# EAGLE design MF_badge_2021_protoshield_ver_B (EAGLE 9.6.2)
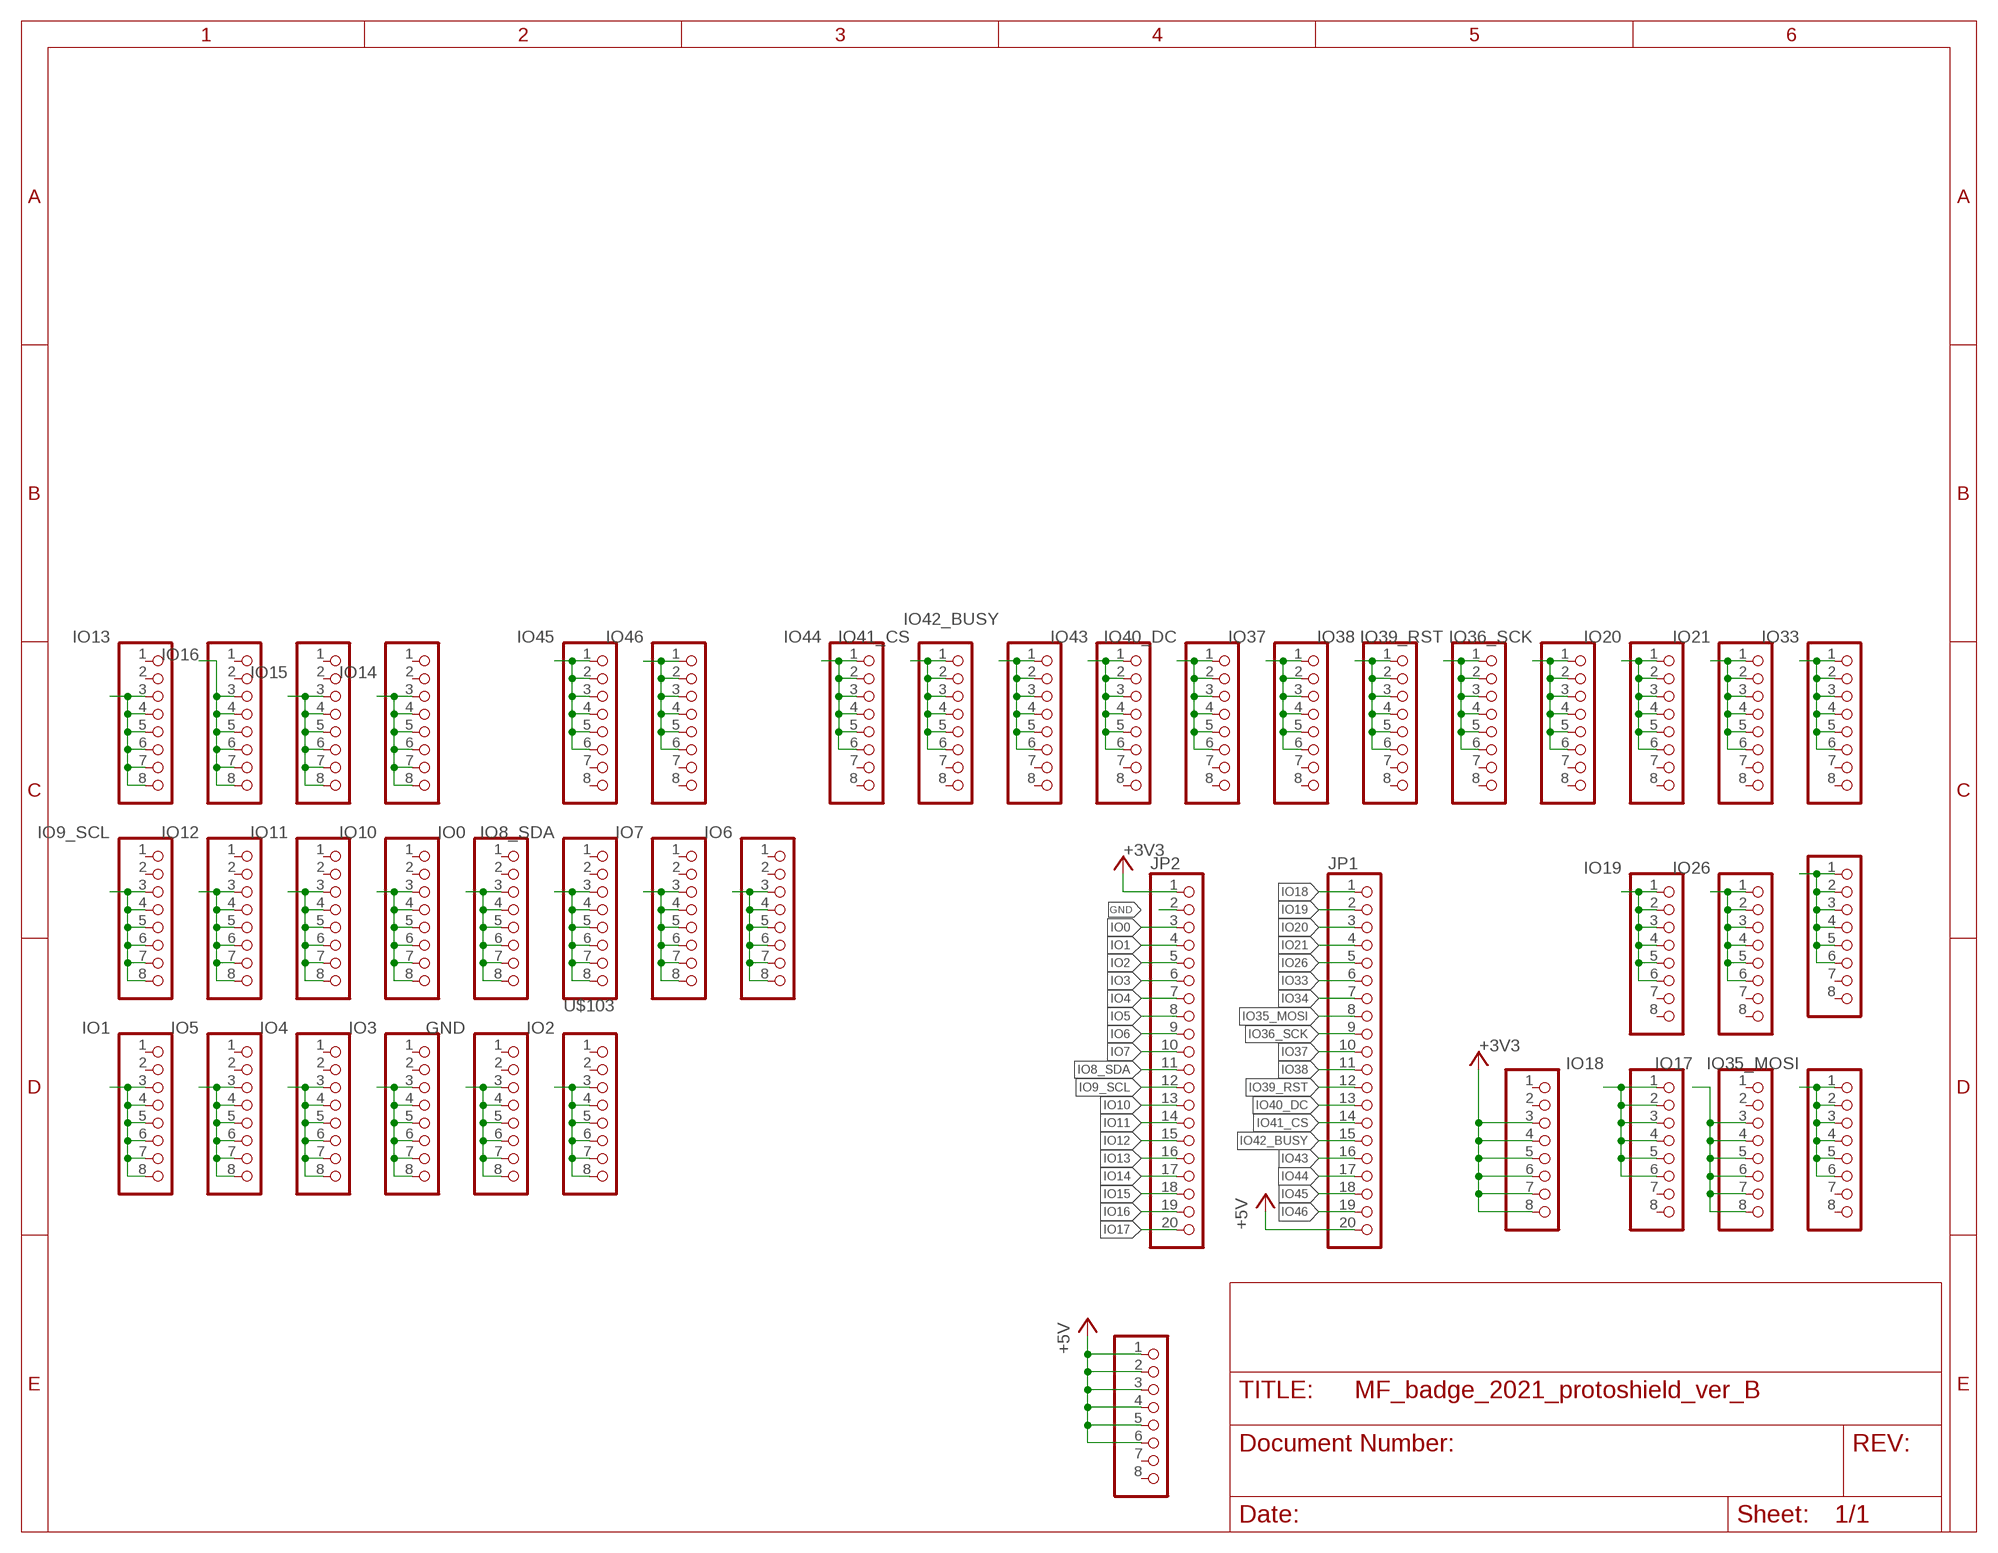
[diagram p0: schematic, sheet 1]

## Parts
JP1  PINHD-1X20_CLEANBIG  [1X20-CLEANBIG]
JP2  PINHD-1X20_CLEANBIG  [1X20-CLEANBIG]
U$1  PINHD-1X8CLEANBIG  [1X08-CLEANBIG]
U$5  PINHD-1X8CLEANBIG  [1X08-CLEANBIG]
U$7  PINHD-1X8CLEANBIG  [1X08-CLEANBIG]
U$8  PINHD-1X8CLEANBIG  [1X08-CLEANBIG]
U$9  PINHD-1X8CLEANBIG  [1X08-CLEANBIG]
U$10  PINHD-1X8CLEANBIG  [1X08-CLEANBIG]
U$11  PINHD-1X8CLEANBIG  [1X08-CLEANBIG]
U$12  PINHD-1X8CLEANBIG  [1X08-CLEANBIG]
U$13  PINHD-1X8CLEANBIG  [1X08-CLEANBIG]
U$14  PINHD-1X8CLEANBIG  [1X08-CLEANBIG]
U$15  PINHD-1X8CLEANBIG  [1X08-CLEANBIG]
U$36  PINHD-1X8CLEANBIG  [1X08-CLEANBIG]
U$52  PINHD-1X8CLEANBIG  [1X08-CLEANBIG]
U$53  PINHD-1X8CLEANBIG  [1X08-CLEANBIG]
U$54  PINHD-1X8CLEANBIG  [1X08-CLEANBIG]
U$55  PINHD-1X8CLEANBIG  [1X08-CLEANBIG]
U$56  PINHD-1X8CLEANBIG  [1X08-CLEANBIG]
U$61  PINHD-1X8CLEANBIG  [1X08-CLEANBIG]
U$62  PINHD-1X8CLEANBIG  [1X08-CLEANBIG]
U$63  PINHD-1X8CLEANBIG  [1X08-CLEANBIG]
U$64  PINHD-1X8CLEANBIG  [1X08-CLEANBIG]
U$102  PINHD-1X8CLEANBIG  [1X08-CLEANBIG]
U$103  PINHD-1X8CLEANBIG  [1X08-CLEANBIG]
U$104  PINHD-1X8CLEANBIG  [1X08-CLEANBIG]
U$105  PINHD-1X8CLEANBIG  [1X08-CLEANBIG]
U$106  PINHD-1X8CLEANBIG  [1X08-CLEANBIG]
U$107  PINHD-1X8CLEANBIG  [1X08-CLEANBIG]
U$108  PINHD-1X8CLEANBIG  [1X08-CLEANBIG]
U$109  PINHD-1X8CLEANBIG  [1X08-CLEANBIG]
U$110  PINHD-1X8CLEANBIG  [1X08-CLEANBIG]
U$111  PINHD-1X8CLEANBIG  [1X08-CLEANBIG]
U$112  PINHD-1X8CLEANBIG  [1X08-CLEANBIG]
U$113  PINHD-1X8CLEANBIG  [1X08-CLEANBIG]
U$114  PINHD-1X8CLEANBIG  [1X08-CLEANBIG]
U$115  PINHD-1X8CLEANBIG  [1X08-CLEANBIG]
U$116  PINHD-1X8CLEANBIG  [1X08-CLEANBIG]
U$117  PINHD-1X8CLEANBIG  [1X08-CLEANBIG]
U$118  PINHD-1X8CLEANBIG  [1X08-CLEANBIG]
U$119  PINHD-1X8CLEANBIG  [1X08-CLEANBIG]
U$120  PINHD-1X8CLEANBIG  [1X08-CLEANBIG]

## Nets
+3V3 [power]: JP2.1 U$1.3 U$1.4 U$1.5 U$1.6 U$1.7 U$1.8
+5V: JP1.20 U$102.1 U$102.2 U$102.3 U$102.4 U$102.5 U$102.6
GND: JP2.2 U$120.3 U$120.4 U$120.5 U$120.6 U$120.7 U$120.8
IO0: JP2.3 U$115.3 U$115.4 U$115.5 U$115.6 U$115.7 U$115.8
IO1: JP2.4 U$119.3 U$119.4 U$119.5 U$119.6 U$119.7 U$119.8
IO2: JP2.5 U$103.3 U$103.4 U$103.5 U$103.6 U$103.7 U$103.8
IO3: JP2.6 U$118.3 U$118.4 U$118.5 U$118.6 U$118.7 U$118.8
IO4: JP2.7 U$117.3 U$117.4 U$117.5 U$117.6 U$117.7 U$117.8
IO5: JP2.8 U$116.3 U$116.4 U$116.5 U$116.6 U$116.7 U$116.8
IO6: JP2.9 U$114.3 U$114.4 U$114.5 U$114.6 U$114.7 U$114.8
IO7: JP2.10 U$113.3 U$113.4 U$113.5 U$113.6 U$113.7 U$113.8
IO8_SDA: JP2.11 U$112.3 U$112.4 U$112.5 U$112.6 U$112.7 U$112.8
IO9_SCL: JP2.12 U$111.3 U$111.4 U$111.5 U$111.6 U$111.7 U$111.8
IO10: JP2.13 U$110.3 U$110.4 U$110.5 U$110.6 U$110.7 U$110.8
IO11: JP2.14 U$109.3 U$109.4 U$109.5 U$109.6 U$109.7 U$109.8
IO12: JP2.15 U$108.3 U$108.4 U$108.5 U$108.6 U$108.7 U$108.8
IO13: JP2.16 U$107.3 U$107.4 U$107.5 U$107.6 U$107.7 U$107.8
IO14: JP2.17 U$106.3 U$106.4 U$106.5 U$106.6 U$106.7 U$106.8
IO15: JP2.18 U$105.3 U$105.4 U$105.5 U$105.6 U$105.7 U$105.8
IO16: JP2.19 U$104.3 U$104.4 U$104.5 U$104.6 U$104.7 U$104.8
IO17: JP2.20 U$7.3 U$7.4 U$7.5 U$7.6 U$7.7 U$7.8
IO18: JP1.1 U$5.1 U$5.2 U$5.3 U$5.4 U$5.5 U$5.6
IO19: JP1.2 U$8.1 U$8.2 U$8.3 U$8.4 U$8.5 U$8.6
IO20: JP1.3 U$9.1 U$9.2 U$9.3 U$9.4 U$9.5 U$9.6
IO21: JP1.4 U$10.1 U$10.2 U$10.3 U$10.4 U$10.5 U$10.6
IO26: JP1.5 U$11.1 U$11.2 U$11.3 U$11.4 U$11.5 U$11.6
IO33: JP1.6 U$12.1 U$12.2 U$12.3 U$12.4 U$12.5 U$12.6
IO34: JP1.7 U$13.1 U$13.2 U$13.3 U$13.4 U$13.5 U$13.6
IO35_MOSI: JP1.8 U$14.1 U$14.2 U$14.3 U$14.4 U$14.5 U$14.6
IO36_SCK: JP1.9 U$15.1 U$15.2 U$15.3 U$15.4 U$15.5 U$15.6
IO37: JP1.10 U$36.1 U$36.2 U$36.3 U$36.4 U$36.5 U$36.6
IO38: JP1.11 U$52.1 U$52.2 U$52.3 U$52.4 U$52.5 U$52.6
IO39_RST: JP1.12 U$53.1 U$53.2 U$53.3 U$53.4 U$53.5 U$53.6
IO40_DC: JP1.13 U$54.1 U$54.2 U$54.3 U$54.4 U$54.5 U$54.6
IO41_CS: JP1.14 U$55.1 U$55.2 U$55.3 U$55.4 U$55.5 U$55.6
IO42_BUSY: JP1.15 U$56.1 U$56.2 U$56.3 U$56.4 U$56.5 U$56.6
IO43: JP1.16 U$61.1 U$61.2 U$61.3 U$61.4 U$61.5 U$61.6
IO44: JP1.17 U$62.1 U$62.2 U$62.3 U$62.4 U$62.5 U$62.6
IO45: JP1.18 U$63.1 U$63.2 U$63.3 U$63.4 U$63.5 U$63.6
IO46: JP1.19 U$64.1 U$64.2 U$64.3 U$64.4 U$64.5 U$64.6
Unconnected: U$1.1 U$1.2 U$5.7 U$5.8 U$7.1 U$7.2 U$8.7 U$8.8 U$9.7 U$9.8 U$10.7 U$10.8 U$11.7 U$11.8 U$12.7 U$12.8 U$13.7 U$13.8 U$14.7 U$14.8 U$15.7 U$15.8 U$36.7 U$36.8 U$52.7 U$52.8 U$53.7 U$53.8 U$54.7 U$54.8 U$55.7 U$55.8 U$56.7 U$56.8 U$61.7 U$61.8 U$62.7 U$62.8 U$63.7 U$63.8 U$64.7 U$64.8 U$102.7 U$102.8 U$103.1 U$103.2 U$104.1 U$104.2 U$105.1 U$105.2 U$106.1 U$106.2 U$107.1 U$107.2 U$108.1 U$108.2 U$109.1 U$109.2 U$110.1 U$110.2 U$111.1 U$111.2 U$112.1 U$112.2 U$113.1 U$113.2 U$114.1 U$114.2 U$115.1 U$115.2 U$116.1 U$116.2 U$117.1 U$117.2 U$118.1 U$118.2 U$119.1 U$119.2 U$120.1 U$120.2

## Library data of the parts
JP1 JP2 = dronecz:PINHD-1X20: PIN HEADER
U$1 U$5 U$7-U$15 U$36 U$52-U$56 U$61-U$64 U$102-U$120 = adafruit:PINHD-1X8: PIN HEADER

## Net classes
1 power: width 0.508 mm
2 lowpower: width 0.305 mm, drill 0.483 mm

## Board
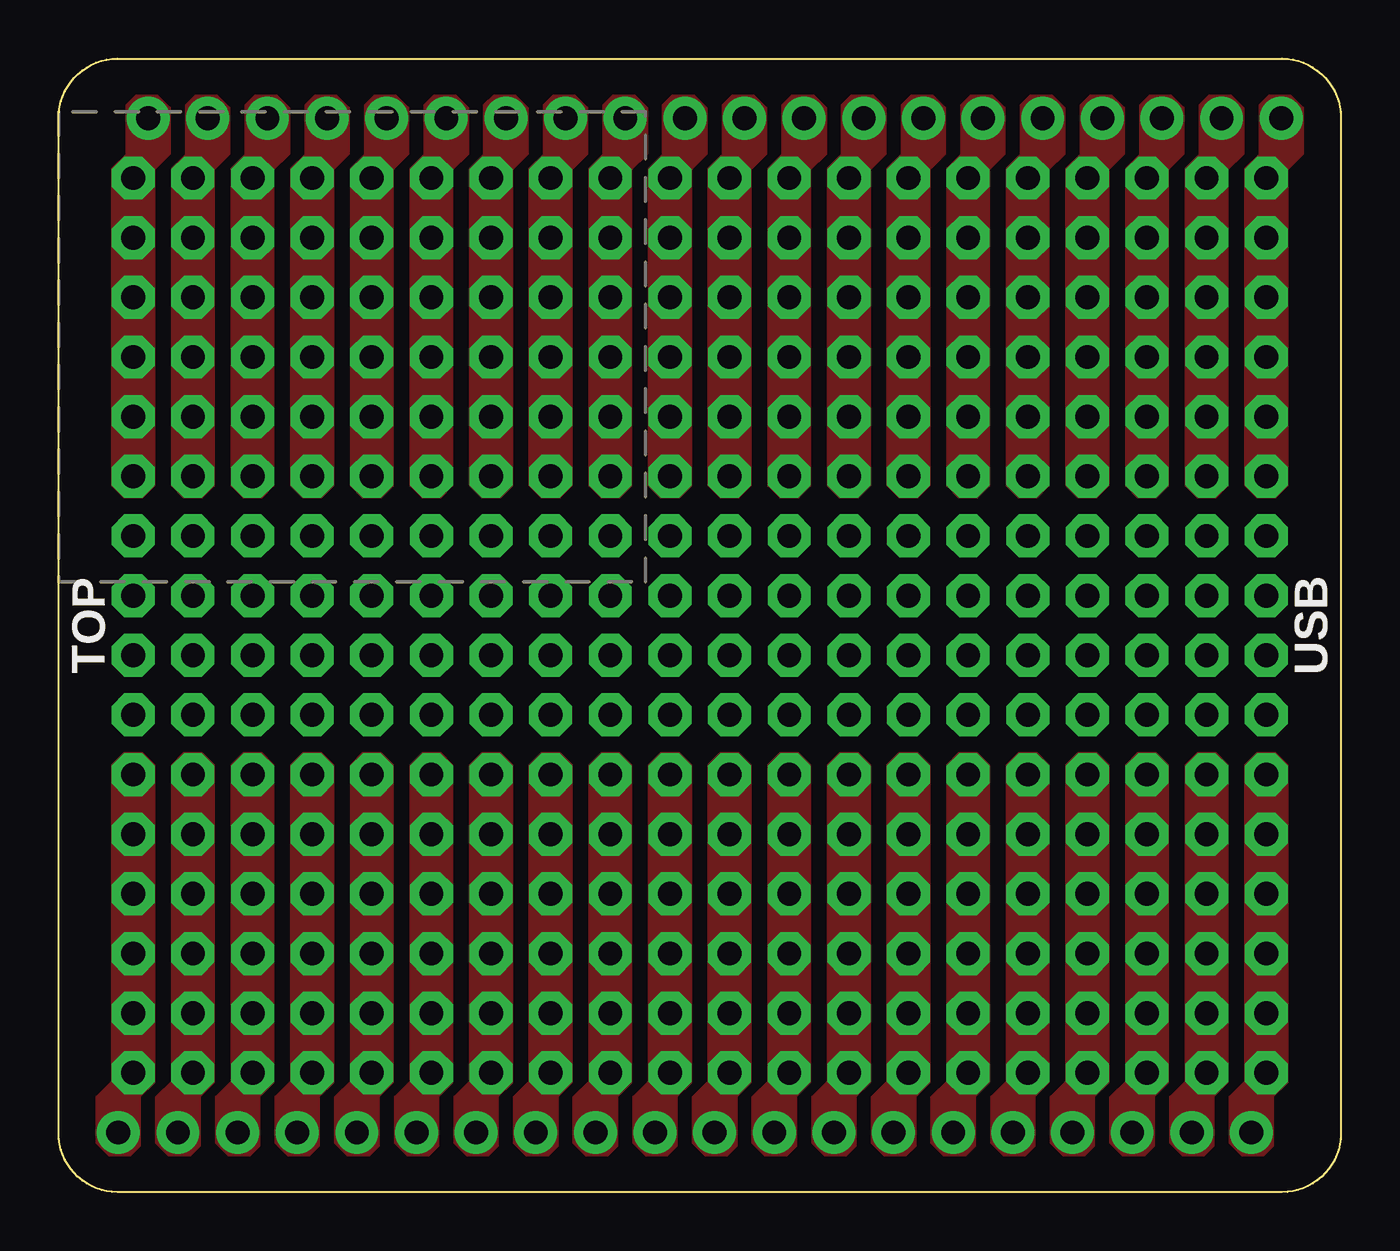
[diagram p1: board, top side]
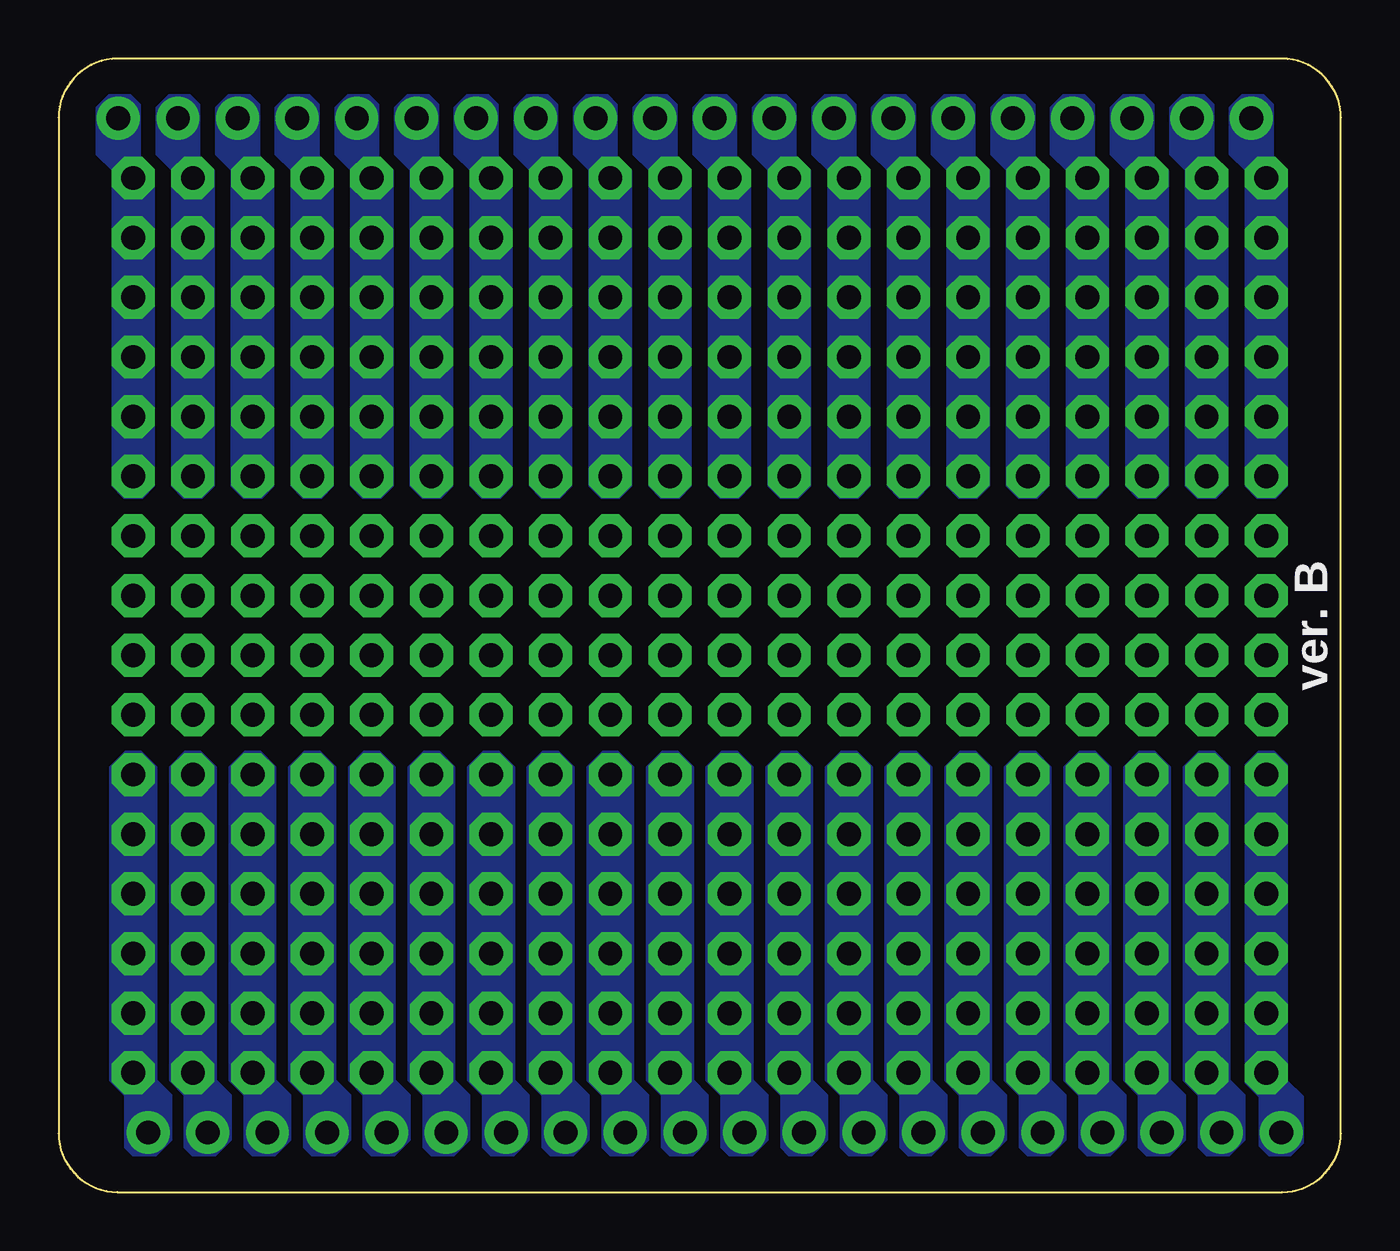
[diagram p2: board, bottom side, seen from below]

Size 54.61 x 48.26 mm. Coordinates in mm from the lower left corner, seen from the top.
Outline: 54.61,45.76 54.61,2.5 arc-90 52.11,0 2.5,0 arc-90 0,2.5 0,45.76 arc-90 2.5,48.26 52.11,48.26 arc-90 54.61,45.76
Copper layers (1*16): Top 0.035mm / dielectric 1.6mm / Bottom 0.035mm
Design rules "jlcpcb2layer *": minimum track width 5mil, minimum drill 0.3mm, track to track 5mil, track to pad 5mil, pad to pad 5mil, via to via 5mil, smd to smd 5mil, copper to edge 0.2mm, drill to drill 6mil, minimum pad ring 10mil, minimum via ring 3mil, stop-mask expansion 4mil, vias tented up to drill 0mil, thermal gap 10mil

### Footprints (pad centres in the part's own frame; a part is rotated, then mirrored left to right if it is on the bottom)
1X20-CLEANBIG = drill 1.016 pad 1.778: 1 -24.13,0; 2 -21.59,0; 3 -19.05,0; 4 -16.51,0; 5 -13.97,0; 6 -11.43,0; 7 -8.89,0; 8 -6.35,0; 9 -3.81,0; 10 -1.27,0; 11 1.27,0; 12 3.81,0; 13 6.35,0; 14 8.89,0; 15 11.43,0; 16 13.97,0; 17 16.51,0; 18 19.05,0; 19 21.59,0; 20 24.13,0
1X08-CLEANBIG = drill 1.016 pad 1.778 octagon: 1 -8.89,0; 2 -6.35,0; 3 -3.81,0; 4 -1.27,0; 5 1.27,0; 6 3.81,0; 7 6.35,0; 8 8.89,0

### Placement (x,y rotation side)
JP1  26.67,2.54 0 top
JP2  27.94,45.72 180 top
U$1  51.44,34.29 90 top
U$5  3.17,13.97 90 top
U$7  3.17,34.29 90 top
U$8  5.71,13.97 90 top
U$9  8.26,13.97 90 top
U$10  10.79,13.97 90 top
U$11  13.34,13.97 90 top
U$12  15.88,13.97 90 top
U$13  18.41,13.97 90 top
U$14  20.95,13.97 90 top
U$15  23.5,13.97 90 top
U$36  26.04,13.97 90 top
U$52  28.57,13.97 90 top
U$53  31.11,13.97 90 top
U$54  33.66,13.97 90 top
U$55  36.2,13.97 90 top
U$56  38.73,13.97 90 top
U$61  41.27,13.97 90 top
U$62  43.81,13.97 90 top
U$63  46.35,13.97 90 top
U$64  48.9,13.97 90 top
U$102  51.44,13.97 90 top
U$103  41.27,34.29 90 top
U$104  5.71,34.29 90 top
U$105  8.26,34.29 90 top
U$106  10.79,34.29 90 top
U$107  13.34,34.29 90 top
U$108  15.88,34.29 90 top
U$109  18.41,34.29 90 top
U$110  20.95,34.29 90 top
U$111  23.5,34.29 90 top
U$112  26.04,34.29 90 top
U$113  28.57,34.29 90 top
U$114  31.11,34.29 90 top
U$115  46.35,34.29 90 top
U$116  33.66,34.29 90 top
U$117  36.2,34.29 90 top
U$118  38.73,34.29 90 top
U$119  43.81,34.29 90 top
U$120  48.9,34.29 90 top

### Tracks (layer width: path | path; a pad name or v marks a point on that pad's centre or on a via)
+3V3
  pour Top (no thermals): 50.55,43.59 51.15,44.2 51.15,46.3 51.55,46.7 52.46,46.7 52.99,46.17 52.99,44.2 52.32,43.53 52.32,30.07 51.82,29.56 51.05,29.56 50.55,30.07
  pour Bottom (no thermals): 51.82,29.59 51.05,29.59 50.58,30.07 50.58,43.5 51.18,44.1 51.18,46.29 51.56,46.67 52.45,46.67 52.96,46.16 52.96,44.2 52.29,43.53 52.29,30.07
+5V
  pour Top (no thermals): 52.32,4.67 51.72,4.06 51.72,1.96 51.32,1.56 50.41,1.56 49.88,2.09 49.88,4.06 50.55,4.73 50.55,18.19 51.05,18.7 51.82,18.7 52.32,18.19
  pour Bottom (no thermals): 51.12,18.73 51.75,18.73 52.39,18.1 52.39,4.76 51.75,4.13 51.75,1.91 51.44,1.59 50.48,1.59 49.85,2.22 49.85,4.13 50.48,4.76 50.48,18.1
GND
  pour Top (no thermals): 48.01,43.59 48.61,44.2 48.61,46.3 49.01,46.7 49.92,46.7 50.45,46.17 50.45,44.2 49.78,43.53 49.78,30.07 49.28,29.56 48.51,29.56 48.01,30.07
  pour Bottom (no thermals): 49.28,29.59 48.51,29.59 48.04,30.07 48.04,43.5 48.64,44.1 48.64,46.29 49.02,46.67 49.91,46.67 50.42,46.16 50.42,44.2 49.75,43.53 49.75,30.07
IO0
  pour Top (no thermals): 45.47,43.59 46.07,44.2 46.07,46.3 46.47,46.7 47.38,46.7 47.91,46.17 47.91,44.2 47.24,43.53 47.24,30.07 46.74,29.56 45.97,29.56 45.47,30.07
  pour Bottom (no thermals): 46.74,29.59 45.97,29.59 45.5,30.07 45.5,43.5 46.1,44.1 46.1,46.29 46.48,46.67 47.37,46.67 47.88,46.16 47.88,44.2 47.21,43.53 47.21,30.07
IO1
  pour Top (no thermals): 42.93,43.59 43.53,44.2 43.53,46.3 43.93,46.7 44.84,46.7 45.37,46.17 45.37,44.2 44.7,43.53 44.7,30.07 44.2,29.56 43.43,29.56 42.93,30.07
  pour Bottom (no thermals): 44.2,29.59 43.43,29.59 42.96,30.07 42.96,43.5 43.56,44.1 43.56,46.29 43.94,46.67 44.83,46.67 45.34,46.16 45.34,44.2 44.67,43.53 44.67,30.07
IO2
  pour Top (no thermals): 40.39,43.59 40.99,44.2 40.99,46.3 41.39,46.7 42.3,46.7 42.83,46.17 42.83,44.2 42.16,43.53 42.16,30.07 41.66,29.56 40.89,29.56 40.39,30.07
  pour Bottom (no thermals): 41.66,29.59 40.89,29.59 40.42,30.07 40.42,43.5 41.02,44.1 41.02,46.29 41.4,46.67 42.29,46.67 42.8,46.16 42.8,44.2 42.13,43.53 42.13,30.07
IO3
  pour Top (no thermals): 37.85,43.59 38.45,44.2 38.45,46.3 38.85,46.7 39.76,46.7 40.29,46.17 40.29,44.2 39.62,43.53 39.62,30.07 39.12,29.56 38.35,29.56 37.85,30.07
  pour Bottom (no thermals): 39.12,29.59 38.35,29.59 37.88,30.07 37.88,43.5 38.48,44.1 38.48,46.29 38.86,46.67 39.75,46.67 40.26,46.16 40.26,44.2 39.59,43.53 39.59,30.07
IO4
  pour Top (no thermals): 35.31,43.59 35.91,44.2 35.91,46.3 36.31,46.7 37.22,46.7 37.75,46.17 37.75,44.2 37.08,43.53 37.08,30.07 36.58,29.56 35.81,29.56 35.31,30.07
  pour Bottom (no thermals): 36.58,29.59 35.81,29.59 35.34,30.07 35.34,43.5 35.94,44.1 35.94,46.29 36.32,46.67 37.21,46.67 37.72,46.16 37.72,44.2 37.05,43.53 37.05,30.07
IO5
  pour Top (no thermals): 32.77,43.59 33.37,44.2 33.37,46.3 33.77,46.7 34.68,46.7 35.21,46.17 35.21,44.2 34.54,43.53 34.54,30.07 34.04,29.56 33.27,29.56 32.77,30.07
  pour Bottom (no thermals): 34.04,29.59 33.27,29.59 32.8,30.07 32.8,43.5 33.4,44.1 33.4,46.29 33.78,46.67 34.67,46.67 35.18,46.16 35.18,44.2 34.51,43.53 34.51,30.07
IO6
  pour Top (no thermals): 30.23,43.59 30.83,44.2 30.83,46.3 31.23,46.7 32.14,46.7 32.67,46.17 32.67,44.2 32,43.53 32,30.07 31.5,29.56 30.73,29.56 30.23,30.07
  pour Bottom (no thermals): 31.5,29.59 30.73,29.59 30.26,30.07 30.26,43.5 30.86,44.1 30.86,46.29 31.24,46.67 32.13,46.67 32.64,46.16 32.64,44.2 31.97,43.53 31.97,30.07
IO7
  pour Top (no thermals): 27.69,43.59 28.29,44.2 28.29,46.3 28.69,46.7 29.6,46.7 30.13,46.17 30.13,44.2 29.46,43.53 29.46,30.07 28.96,29.56 28.19,29.56 27.69,30.07
  pour Bottom (no thermals): 28.96,29.59 28.19,29.59 27.72,30.07 27.72,43.5 28.32,44.1 28.32,46.29 28.7,46.67 29.59,46.67 30.1,46.16 30.1,44.2 29.43,43.53 29.43,30.07
IO8_SDA
  pour Top (no thermals): 25.15,43.59 25.75,44.2 25.75,46.3 26.15,46.7 27.06,46.7 27.59,46.17 27.59,44.2 26.92,43.53 26.92,30.07 26.42,29.56 25.65,29.56 25.15,30.07
  pour Bottom (no thermals): 26.42,29.59 25.65,29.59 25.18,30.07 25.18,43.5 25.78,44.1 25.78,46.29 26.16,46.67 27.05,46.67 27.56,46.16 27.56,44.2 26.89,43.53 26.89,30.07
IO9_SCL
  pour Top (no thermals): 22.61,43.59 23.21,44.2 23.21,46.3 23.61,46.7 24.52,46.7 25.05,46.17 25.05,44.2 24.38,43.53 24.38,30.07 23.88,29.56 23.11,29.56 22.61,30.07
  pour Bottom (no thermals): 23.88,29.59 23.11,29.59 22.64,30.07 22.64,43.5 23.24,44.1 23.24,46.29 23.62,46.67 24.51,46.67 25.02,46.16 25.02,44.2 24.35,43.53 24.35,30.07
IO10
  pour Top (no thermals): 20.07,43.59 20.67,44.2 20.67,46.3 21.07,46.7 21.98,46.7 22.51,46.17 22.51,44.2 21.84,43.53 21.84,30.07 21.34,29.56 20.57,29.56 20.07,30.07
  pour Bottom (no thermals): 21.34,29.59 20.57,29.59 20.1,30.07 20.1,43.5 20.7,44.1 20.7,46.29 21.08,46.67 21.97,46.67 22.48,46.16 22.48,44.2 21.81,43.53 21.81,30.07
IO11
  pour Top (no thermals): 17.53,43.59 18.13,44.2 18.13,46.3 18.53,46.7 19.44,46.7 19.97,46.17 19.97,44.2 19.3,43.53 19.3,30.07 18.8,29.56 18.03,29.56 17.53,30.07
  pour Bottom (no thermals): 18.8,29.59 18.03,29.59 17.56,30.07 17.56,43.5 18.16,44.1 18.16,46.29 18.54,46.67 19.43,46.67 19.94,46.16 19.94,44.2 19.27,43.53 19.27,30.07
IO12
  pour Top (no thermals): 14.99,43.59 15.59,44.2 15.59,46.3 15.99,46.7 16.9,46.7 17.43,46.17 17.43,44.2 16.76,43.53 16.76,30.07 16.26,29.56 15.49,29.56 14.99,30.07
  pour Bottom (no thermals): 16.26,29.59 15.49,29.59 15.02,30.07 15.02,43.5 15.62,44.1 15.62,46.29 16,46.67 16.89,46.67 17.4,46.16 17.4,44.2 16.73,43.53 16.73,30.07
IO13
  pour Top (no thermals): 12.45,43.59 13.05,44.2 13.05,46.3 13.45,46.7 14.36,46.7 14.89,46.17 14.89,44.2 14.22,43.53 14.22,30.07 13.72,29.56 12.95,29.56 12.45,30.07
  pour Bottom (no thermals): 13.72,29.59 12.95,29.59 12.48,30.07 12.48,43.5 13.08,44.1 13.08,46.29 13.46,46.67 14.35,46.67 14.86,46.16 14.86,44.2 14.19,43.53 14.19,30.07
IO14
  pour Top (no thermals): 9.91,43.59 10.51,44.2 10.51,46.3 10.91,46.7 11.82,46.7 12.35,46.17 12.35,44.2 11.68,43.53 11.68,30.07 11.18,29.56 10.41,29.56 9.91,30.07
  pour Bottom (no thermals): 11.18,29.59 10.41,29.59 9.94,30.07 9.94,43.5 10.54,44.1 10.54,46.29 10.92,46.67 11.81,46.67 12.32,46.16 12.32,44.2 11.65,43.53 11.65,30.07
IO15
  pour Top (no thermals): 7.37,43.59 7.97,44.2 7.97,46.3 8.37,46.7 9.28,46.7 9.81,46.17 9.81,44.2 9.14,43.53 9.14,30.07 8.64,29.56 7.87,29.56 7.37,30.07
  pour Bottom (no thermals): 8.64,29.59 7.87,29.59 7.4,30.07 7.4,43.5 8,44.1 8,46.29 8.38,46.67 9.27,46.67 9.78,46.16 9.78,44.2 9.11,43.53 9.11,30.07
IO16
  pour Top (no thermals): 4.83,43.59 5.43,44.2 5.43,46.3 5.83,46.7 6.74,46.7 7.27,46.17 7.27,44.2 6.6,43.53 6.6,30.07 6.1,29.56 5.33,29.56 4.83,30.07
  pour Bottom (no thermals): 6.1,29.59 5.33,29.59 4.86,30.07 4.86,43.5 5.46,44.1 5.46,46.29 5.84,46.67 6.73,46.67 7.24,46.16 7.24,44.2 6.57,43.53 6.57,30.07
IO17
  pour Top (no thermals): 2.29,43.59 2.89,44.2 2.89,46.3 3.29,46.7 4.2,46.7 4.73,46.17 4.73,44.2 4.06,43.53 4.06,30.07 3.56,29.56 2.79,29.56 2.29,30.07
  pour Bottom (no thermals): 3.56,29.59 2.79,29.59 2.32,30.07 2.32,43.5 2.92,44.1 2.92,46.29 3.3,46.67 4.19,46.67 4.7,46.16 4.7,44.2 4.03,43.53 4.03,30.07
IO18
  pour Top (no thermals): 4.06,4.67 3.46,4.06 3.46,1.96 3.06,1.56 2.15,1.56 1.62,2.09 1.62,4.06 2.29,4.73 2.29,18.19 2.79,18.7 3.56,18.7 4.06,18.19
  pour Bottom (no thermals): 2.86,18.73 3.49,18.73 4.03,18.19 4.03,4.67 3.43,4.06 3.43,1.97 3.05,1.59 2.16,1.59 1.65,2.1 1.65,4.06 2.32,4.73 2.32,18.19
IO19
  pour Top (no thermals): 6.6,4.67 6,4.06 6,1.96 5.6,1.56 4.69,1.56 4.16,2.09 4.16,4.06 4.83,4.73 4.83,18.19 5.33,18.7 6.1,18.7 6.6,18.19
  pour Bottom (no thermals): 5.4,18.73 6.03,18.73 6.67,18.1 6.67,4.76 6.03,4.13 6.03,1.91 5.71,1.59 4.76,1.59 4.13,2.22 4.13,4.13 4.76,4.76 4.76,18.1
IO20
  pour Top (no thermals): 9.14,4.67 8.54,4.06 8.54,1.96 8.14,1.56 7.23,1.56 6.7,2.09 6.7,4.06 7.37,4.73 7.37,18.19 7.87,18.7 8.64,18.7 9.14,18.19
  pour Bottom (no thermals): 7.94,18.73 8.57,18.73 9.21,18.1 9.21,4.76 8.57,4.13 8.57,1.91 8.26,1.59 7.3,1.59 6.67,2.22 6.67,4.13 7.3,4.76 7.3,18.1
IO21
  pour Top (no thermals): 11.68,4.67 11.08,4.06 11.08,1.96 10.68,1.56 9.77,1.56 9.24,2.09 9.24,4.06 9.91,4.73 9.91,18.19 10.41,18.7 11.18,18.7 11.68,18.19
  pour Bottom (no thermals): 10.48,18.73 11.11,18.73 11.75,18.1 11.75,4.76 11.11,4.13 11.11,1.91 10.79,1.59 9.84,1.59 9.21,2.22 9.21,4.13 9.84,4.76 9.84,18.1
IO26
  pour Top (no thermals): 14.22,4.67 13.62,4.06 13.62,1.96 13.22,1.56 12.31,1.56 11.78,2.09 11.78,4.06 12.45,4.73 12.45,18.19 12.95,18.7 13.72,18.7 14.22,18.19
  pour Bottom (no thermals): 13.02,18.73 13.65,18.73 14.29,18.1 14.29,4.76 13.65,4.13 13.65,1.91 13.34,1.59 12.38,1.59 11.75,2.22 11.75,4.13 12.38,4.76 12.38,18.1
IO33
  pour Top (no thermals): 16.76,4.67 16.16,4.06 16.16,1.96 15.76,1.56 14.85,1.56 14.32,2.09 14.32,4.06 14.99,4.73 14.99,18.19 15.49,18.7 16.26,18.7 16.76,18.19
  pour Bottom (no thermals): 15.56,18.73 16.19,18.73 16.83,18.1 16.83,4.76 16.19,4.13 16.19,1.91 15.88,1.59 14.92,1.59 14.29,2.22 14.29,4.13 14.92,4.76 14.92,18.1
IO34
  pour Top (no thermals): 19.3,4.67 18.7,4.06 18.7,1.96 18.3,1.56 17.39,1.56 16.86,2.09 16.86,4.06 17.53,4.73 17.53,18.19 18.03,18.7 18.8,18.7 19.3,18.19
  pour Bottom (no thermals): 18.1,18.73 18.73,18.73 19.37,18.1 19.37,4.76 18.73,4.13 18.73,1.91 18.41,1.59 17.46,1.59 16.83,2.22 16.83,4.13 17.46,4.76 17.46,18.1
IO35_MOSI
  pour Top (no thermals): 21.84,4.67 21.24,4.06 21.24,1.96 20.84,1.56 19.93,1.56 19.4,2.09 19.4,4.06 20.07,4.73 20.07,18.19 20.57,18.7 21.34,18.7 21.84,18.19
  pour Bottom (no thermals): 20.64,18.73 21.27,18.73 21.91,18.1 21.91,4.76 21.27,4.13 21.27,1.91 20.95,1.59 20,1.59 19.37,2.22 19.37,4.13 20,4.76 20,18.1
IO36_SCK
  pour Top (no thermals): 24.38,4.67 23.78,4.06 23.78,1.96 23.38,1.56 22.47,1.56 21.94,2.09 21.94,4.06 22.61,4.73 22.61,18.19 23.11,18.7 23.88,18.7 24.38,18.19
  pour Bottom (no thermals): 23.18,18.73 23.81,18.73 24.45,18.1 24.45,4.76 23.81,4.13 23.81,1.91 23.5,1.59 22.54,1.59 21.91,2.22 21.91,4.13 22.54,4.76 22.54,18.1
IO37
  pour Top (no thermals): 26.92,4.67 26.32,4.06 26.32,1.96 25.92,1.56 25.01,1.56 24.48,2.09 24.48,4.06 25.15,4.73 25.15,18.19 25.65,18.7 26.42,18.7 26.92,18.19
  pour Bottom (no thermals): 25.72,18.73 26.35,18.73 26.99,18.1 26.99,4.76 26.35,4.13 26.35,1.91 26.04,1.59 25.08,1.59 24.45,2.22 24.45,4.13 25.08,4.76 25.08,18.1
IO38
  pour Top (no thermals): 29.46,4.67 28.86,4.06 28.86,1.96 28.46,1.56 27.55,1.56 27.02,2.09 27.02,4.06 27.69,4.73 27.69,18.19 28.19,18.7 28.96,18.7 29.46,18.19
  pour Bottom (no thermals): 28.26,18.73 28.89,18.73 29.53,18.1 29.53,4.76 28.89,4.13 28.89,1.91 28.57,1.59 27.62,1.59 26.99,2.22 26.99,4.13 27.62,4.76 27.62,18.1
IO39_RST
  pour Top (no thermals): 32,4.67 31.4,4.06 31.4,1.96 31,1.56 30.09,1.56 29.56,2.09 29.56,4.06 30.23,4.73 30.23,18.19 30.73,18.7 31.5,18.7 32,18.19
  pour Bottom (no thermals): 30.8,18.73 31.43,18.73 32.07,18.1 32.07,4.76 31.43,4.13 31.43,1.91 31.11,1.59 30.16,1.59 29.53,2.22 29.53,4.13 30.16,4.76 30.16,18.1
IO40_DC
  pour Top (no thermals): 34.54,4.67 33.94,4.06 33.94,1.96 33.54,1.56 32.63,1.56 32.1,2.09 32.1,4.06 32.77,4.73 32.77,18.19 33.27,18.7 34.04,18.7 34.54,18.19
  pour Bottom (no thermals): 33.34,18.73 33.97,18.73 34.61,18.1 34.61,4.76 33.97,4.13 33.97,1.91 33.66,1.59 32.7,1.59 32.07,2.22 32.07,4.13 32.7,4.76 32.7,18.1
IO41_CS
  pour Top (no thermals): 37.08,4.67 36.48,4.06 36.48,1.96 36.08,1.56 35.17,1.56 34.64,2.09 34.64,4.06 35.31,4.73 35.31,18.19 35.81,18.7 36.58,18.7 37.08,18.19
  pour Bottom (no thermals): 35.88,18.73 36.51,18.73 37.15,18.1 37.15,4.76 36.51,4.13 36.51,1.91 36.2,1.59 35.24,1.59 34.61,2.22 34.61,4.13 35.24,4.76 35.24,18.1
IO42_BUSY
  pour Top (no thermals): 39.62,4.67 39.02,4.06 39.02,1.96 38.62,1.56 37.71,1.56 37.18,2.09 37.18,4.06 37.85,4.73 37.85,18.19 38.35,18.7 39.12,18.7 39.62,18.19
  pour Bottom (no thermals): 38.42,18.73 39.05,18.73 39.69,18.1 39.69,4.76 39.05,4.13 39.05,1.91 38.73,1.59 37.78,1.59 37.15,2.22 37.15,4.13 37.78,4.76 37.78,18.1
IO43
  pour Top (no thermals): 42.16,4.67 41.56,4.06 41.56,1.96 41.16,1.56 40.25,1.56 39.72,2.09 39.72,4.06 40.39,4.73 40.39,18.19 40.89,18.7 41.66,18.7 42.16,18.19
  pour Bottom (no thermals): 40.96,18.73 41.59,18.73 42.23,18.1 42.23,4.76 41.59,4.13 41.59,1.91 41.27,1.59 40.32,1.59 39.69,2.22 39.69,4.13 40.32,4.76 40.32,18.1
IO44
  pour Top (no thermals): 44.7,4.67 44.1,4.06 44.1,1.96 43.7,1.56 42.79,1.56 42.26,2.09 42.26,4.06 42.93,4.73 42.93,18.19 43.43,18.7 44.2,18.7 44.7,18.19
  pour Bottom (no thermals): 43.5,18.73 44.13,18.73 44.77,18.1 44.77,4.76 44.13,4.13 44.13,1.91 43.81,1.59 42.86,1.59 42.23,2.22 42.23,4.13 42.86,4.76 42.86,18.1
IO45
  pour Top (no thermals): 47.24,4.67 46.64,4.06 46.64,1.96 46.24,1.56 45.33,1.56 44.8,2.09 44.8,4.06 45.47,4.73 45.47,18.19 45.97,18.7 46.74,18.7 47.24,18.19
  pour Bottom (no thermals): 46.04,18.73 46.67,18.73 47.31,18.1 47.31,4.76 46.67,4.13 46.67,1.91 46.35,1.59 45.4,1.59 44.77,2.22 44.77,4.13 45.4,4.76 45.4,18.1
IO46
  pour Top (no thermals): 49.78,4.67 49.18,4.06 49.18,1.96 48.78,1.56 47.87,1.56 47.34,2.09 47.34,4.06 48.01,4.73 48.01,18.19 48.51,18.7 49.28,18.7 49.78,18.19
  pour Bottom (no thermals): 48.58,18.73 49.21,18.73 49.85,18.1 49.85,4.76 49.21,4.13 49.21,1.91 48.9,1.59 47.94,1.59 47.31,2.22 47.31,4.13 47.94,4.76 47.94,18.1

### Text on the board
tPlace: TOP | USB
bPlace: ver. B